# EAGLE design AxionAdapter (EAGLE 9.6.2)
REV: 1
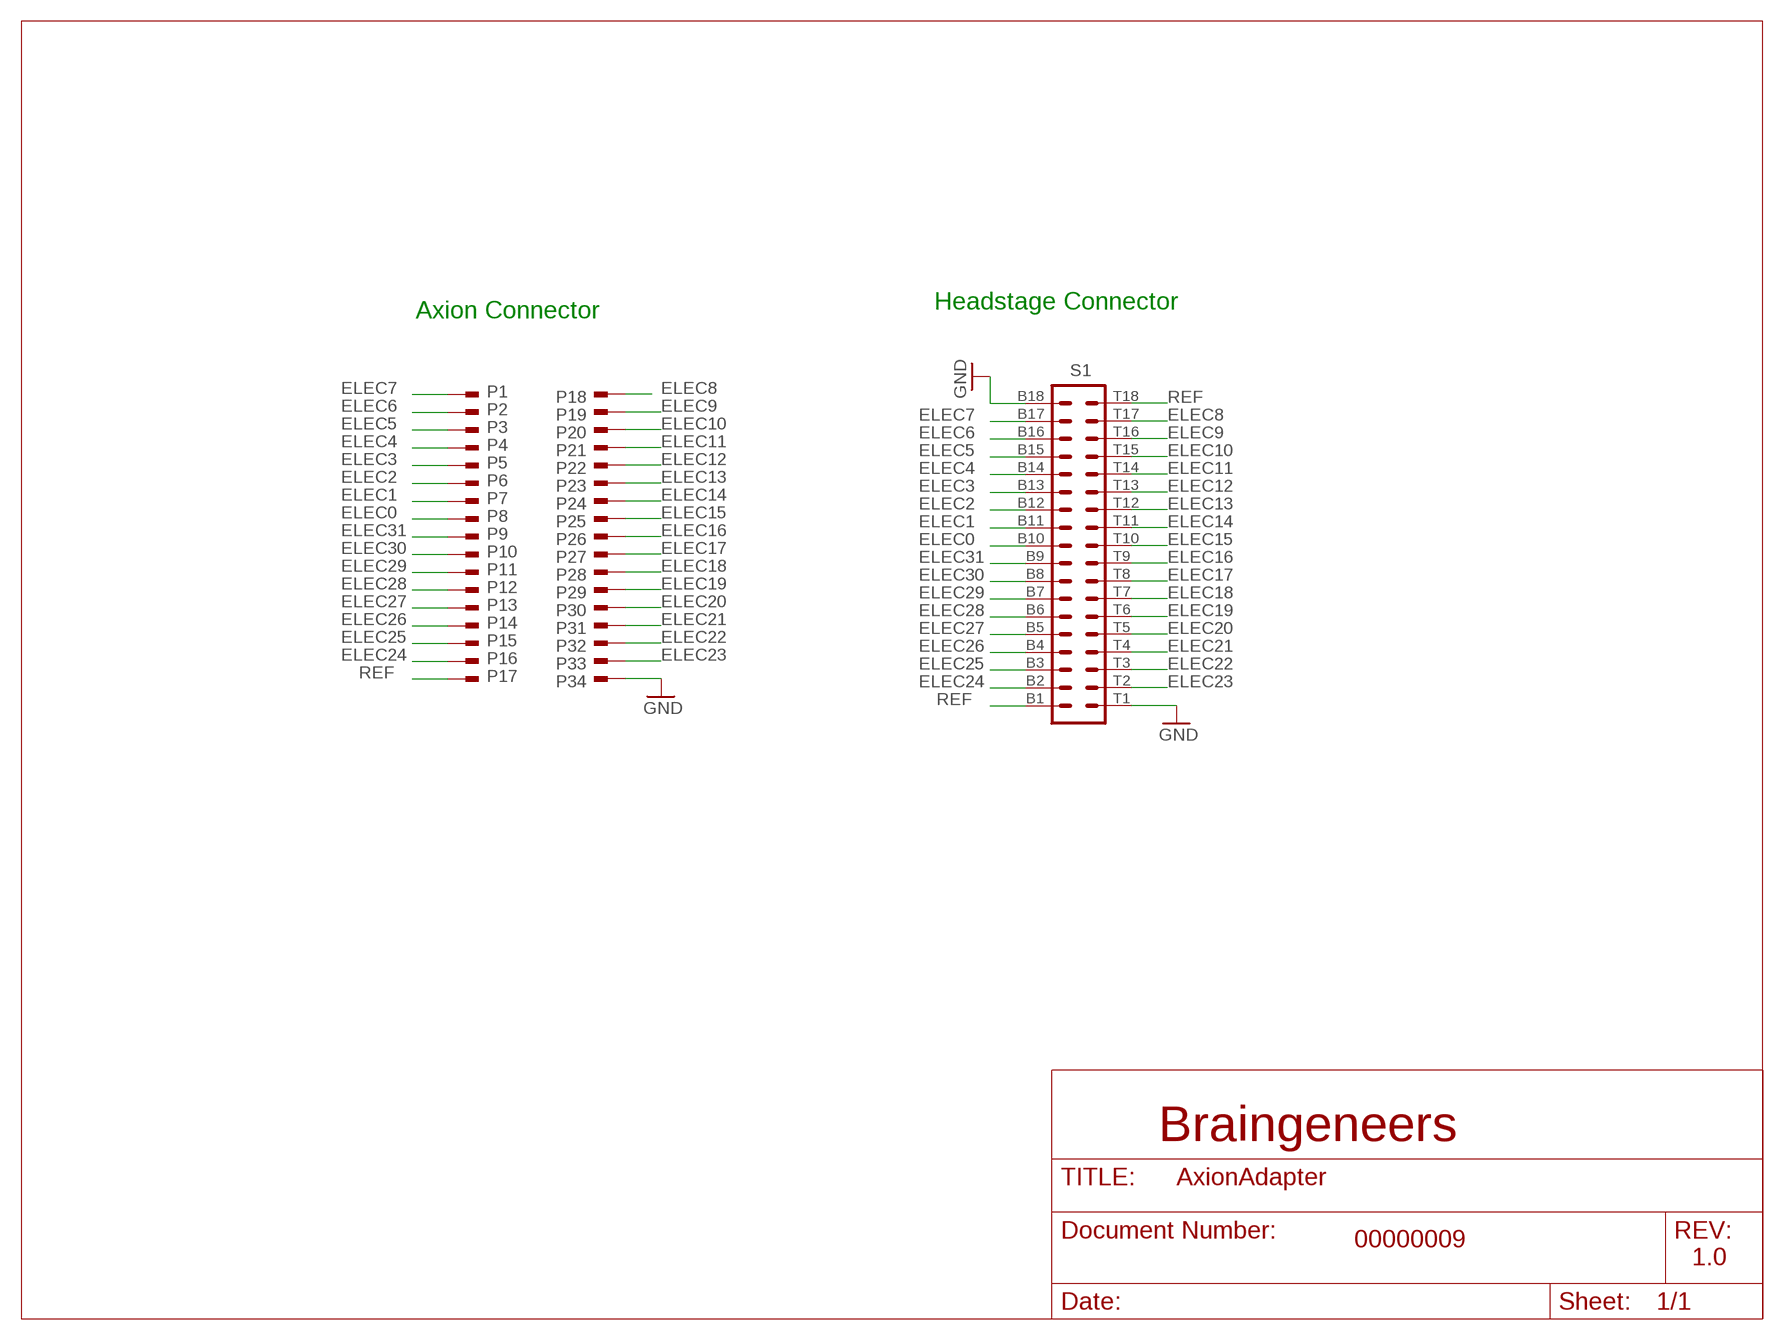
[diagram p0: schematic, sheet 1]

## Parts
P1  2336713-2_TE  [2336713-2_TE]
P2  2336713-2_TE  [2336713-2_TE]
P3  2336713-2_TE  [2336713-2_TE]
P4  2336713-2_TE  [2336713-2_TE]
P5  2336713-2_TE  [2336713-2_TE]
P6  2336713-2_TE  [2336713-2_TE]
P7  2336713-2_TE  [2336713-2_TE]
P8  2336713-2_TE  [2336713-2_TE]
P9  2336713-2_TE  [2336713-2_TE]
P10  2336713-2_TE  [2336713-2_TE]
P11  2336713-2_TE  [2336713-2_TE]
P12  2336713-2_TE  [2336713-2_TE]
P13  2336713-2_TE  [2336713-2_TE]
P14  2336713-2_TE  [2336713-2_TE]
P15  2336713-2_TE  [2336713-2_TE]
P16  2336713-2_TE  [2336713-2_TE]
P17  2336713-2_TE  [2336713-2_TE]
P18  2336713-2_TE  [2336713-2_TE]
P19  2336713-2_TE  [2336713-2_TE]
P20  2336713-2_TE  [2336713-2_TE]
P21  2336713-2_TE  [2336713-2_TE]
P22  2336713-2_TE  [2336713-2_TE]
P23  2336713-2_TE  [2336713-2_TE]
P24  2336713-2_TE  [2336713-2_TE]
P25  2336713-2_TE  [2336713-2_TE]
P26  2336713-2_TE  [2336713-2_TE]
P27  2336713-2_TE  [2336713-2_TE]
P28  2336713-2_TE  [2336713-2_TE]
P29  2336713-2_TE  [2336713-2_TE]
P30  2336713-2_TE  [2336713-2_TE]
P31  2336713-2_TE  [2336713-2_TE]
P32  2336713-2_TE  [2336713-2_TE]
P33  2336713-2_TE  [2336713-2_TE]
P34  2336713-2_TE  [2336713-2_TE]
S1  OMNETICS_A79024  [OMNETICS_A79024]

## Nets
ELEC0: P8.P$1 P8.P$2 S1.B10
ELEC1: P7.P$1 P7.P$2 S1.B11
ELEC2: P6.P$1 P6.P$2 S1.B12
ELEC3: P5.P$1 P5.P$2 S1.B13
ELEC4: P4.P$1 P4.P$2 S1.B14
ELEC5: P3.P$1 P3.P$2 S1.B15
ELEC6: P2.P$1 P2.P$2 S1.B16
ELEC7: P1.P$1 P1.P$2 S1.B17
ELEC8: P18.P$1 P18.P$2 S1.T17
ELEC9: P19.P$1 P19.P$2 S1.T16
ELEC10: P20.P$1 P20.P$2 S1.T15
ELEC11: P21.P$1 P21.P$2 S1.T14
ELEC12: P22.P$1 P22.P$2 S1.T13
ELEC13: P23.P$1 P23.P$2 S1.T12
ELEC14: P24.P$1 P24.P$2 S1.T11
ELEC15: P25.P$1 P25.P$2 S1.T10
ELEC16: P26.P$1 P26.P$2 S1.T9
ELEC17: P27.P$1 P27.P$2 S1.T8
ELEC18: P28.P$1 P28.P$2 S1.T7
ELEC19: P29.P$1 P29.P$2 S1.T6
ELEC20: P30.P$1 P30.P$2 S1.T5
ELEC21: P31.P$1 P31.P$2 S1.T4
ELEC22: P32.P$1 P32.P$2 S1.T3
ELEC23: P33.P$1 P33.P$2 S1.T2
ELEC24: P16.P$1 P16.P$2 S1.B2
ELEC25: P15.P$1 P15.P$2 S1.B3
ELEC26: P14.P$1 P14.P$2 S1.B4
ELEC27: P13.P$1 P13.P$2 S1.B5
ELEC28: P12.P$1 P12.P$2 S1.B6
ELEC29: P11.P$1 P11.P$2 S1.B7
ELEC30: P10.P$1 P10.P$2 S1.B8
ELEC31: P9.P$1 P9.P$2 S1.B9
GND [power]: P34.P$1 P34.P$2 S1.B18 S1.T1
REF: P17.P$1 P17.P$2 S1.B1 S1.T18

## Notes on the sheet
- Headstage Connector
- Axion Connector
- Braingeneers
- 00000009
- 1.0

## Library data of the parts
P1-P34 = Braingeneers_Lib:2336713-2_TE
S1 = Braingeneers_Lib:OMNETICS_A79024: Omnetics A79024 36-pin connector

## Net classes
0 default: width 0.152 mm
1 thick: width 0.254 mm
2 power: width 0.61 mm
3 diff pairs: width 0.152 mm

## Board
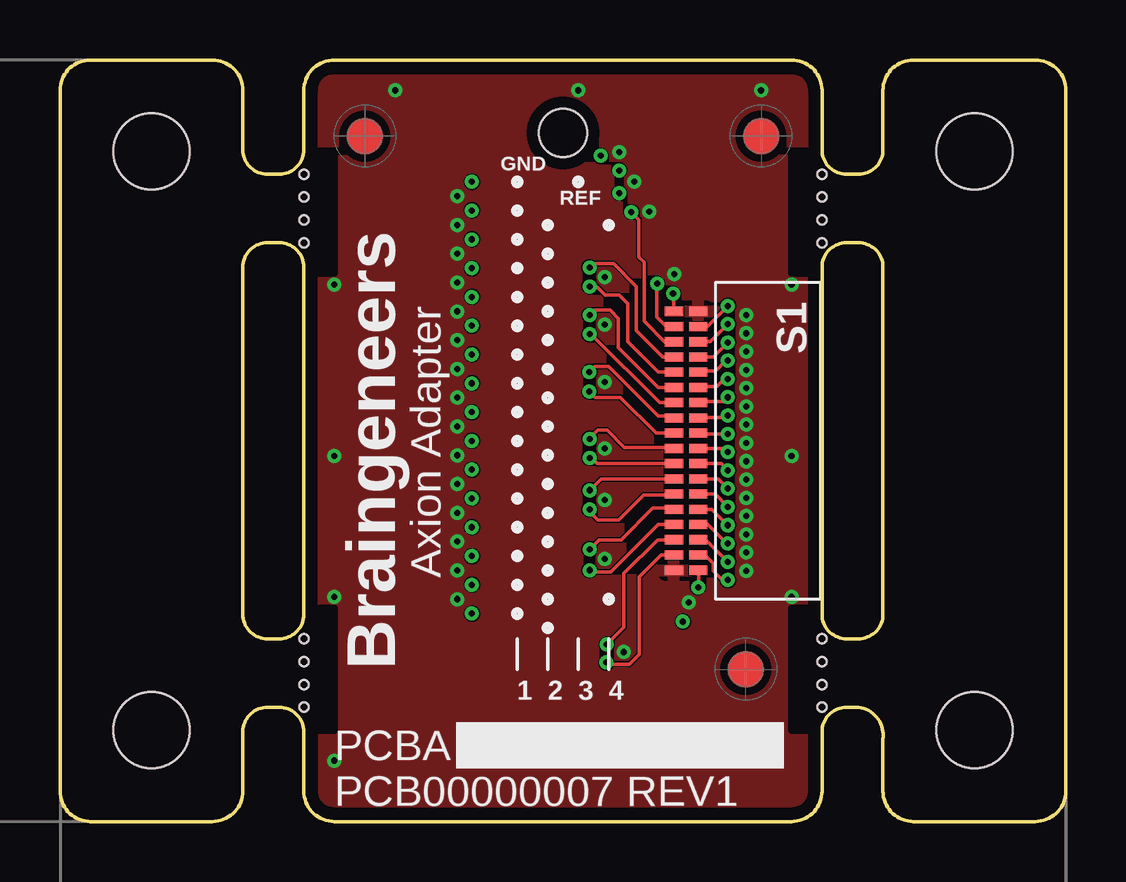
[diagram p1: board, top side]
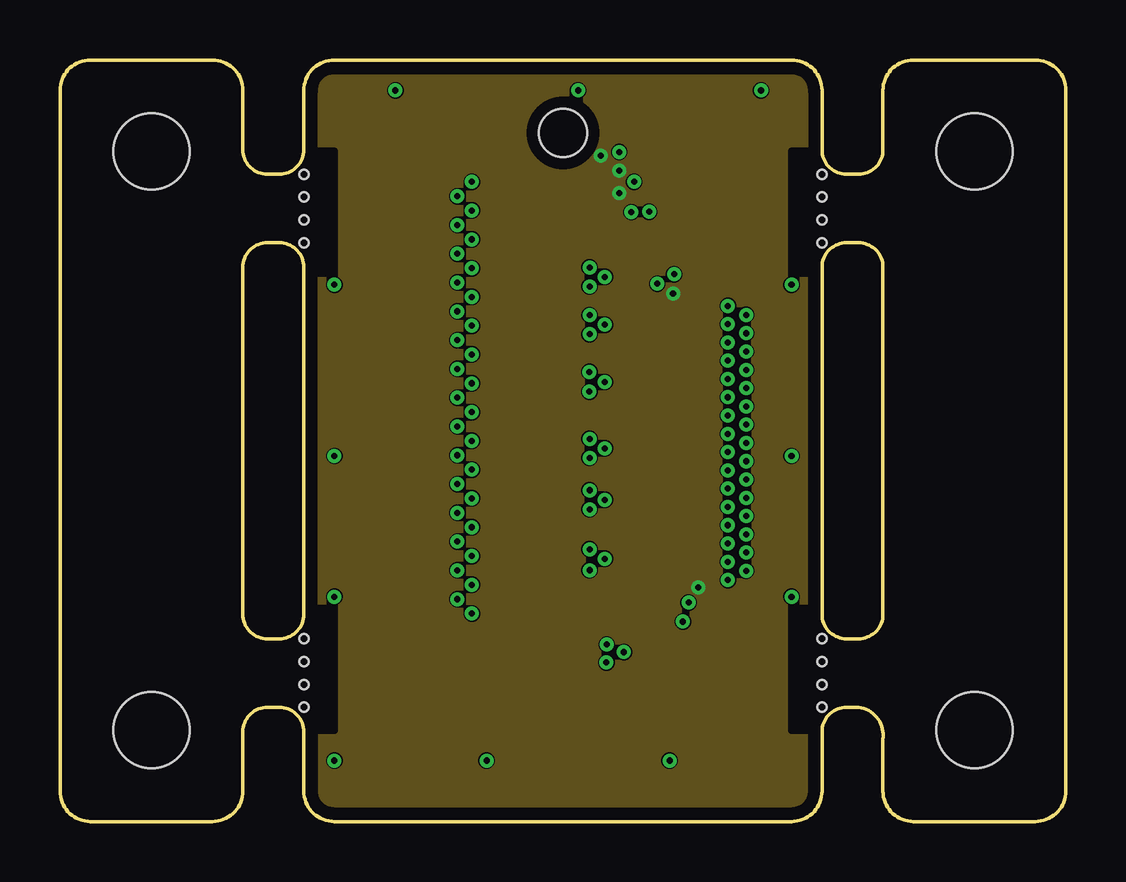
[diagram p2: board, inner layer Signal/Power2]
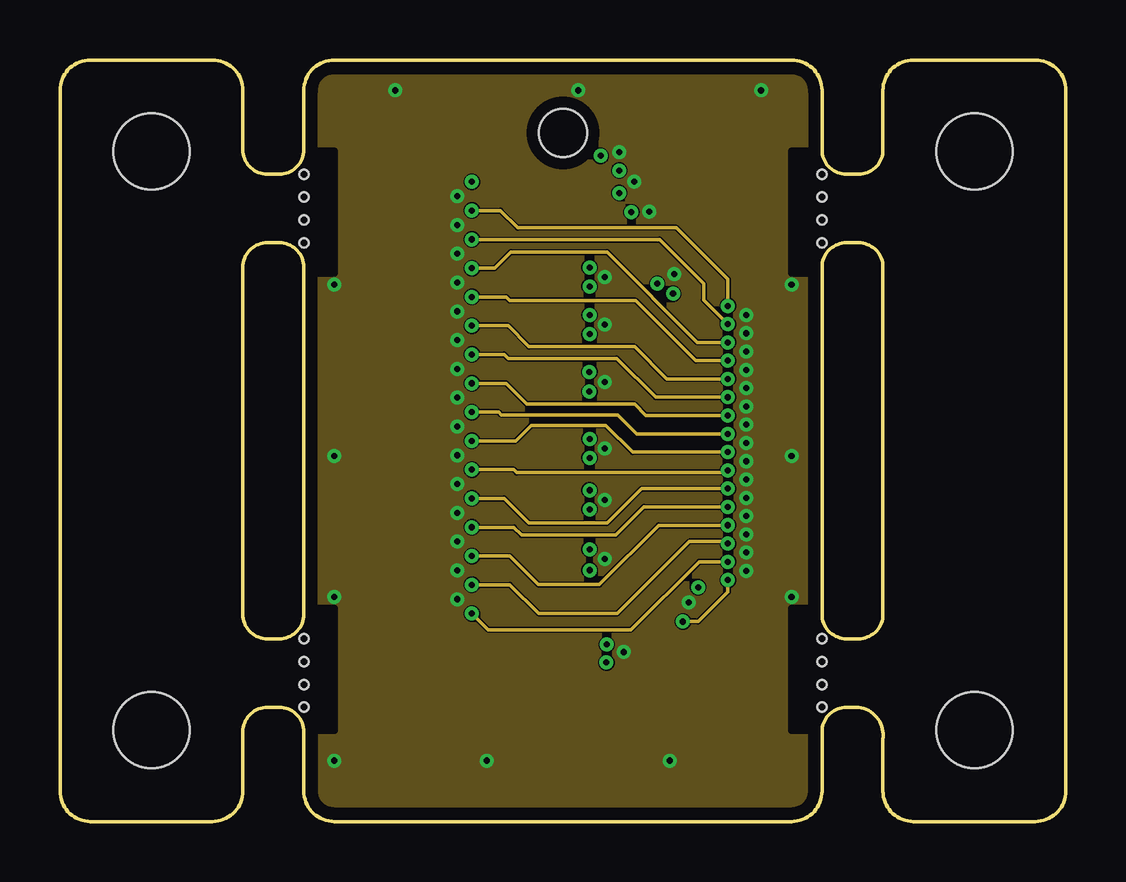
[diagram p3: board, inner layer Signal/Power3]
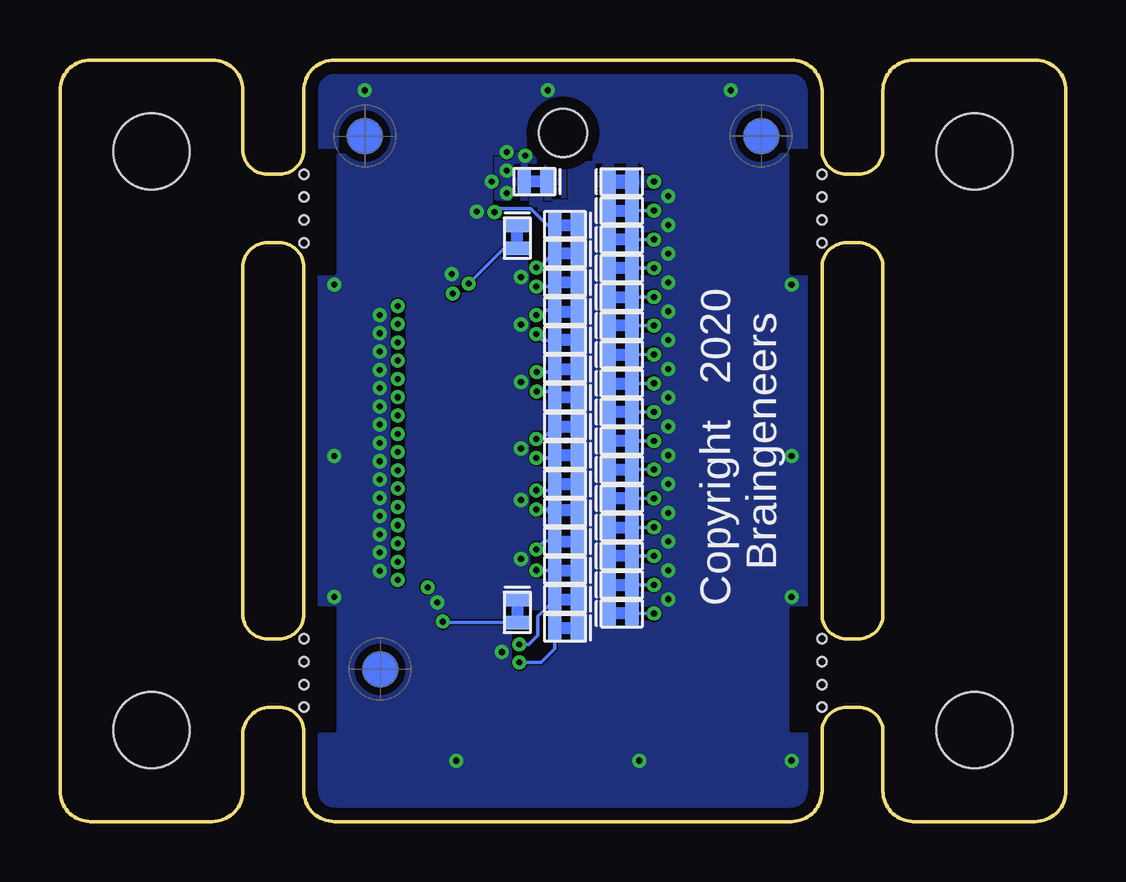
[diagram p4: board, bottom side, seen from below]

Size 41.91 x 31.75 mm. Coordinates in mm from the lower left corner, seen from the top.
Outline: 31.75,1.27 31.75,3.75 arc-90 32.77,4.76 33.27,4.76 arc-90 34.29,3.43 34.29,1.27 arc90 35.56,0 40.64,0 arc90 41.91,1.27 41.91,30.48 arc90 40.64,31.75 35.56,31.75 arc90 34.29,30.48 34.29,28 arc-90 33.27,26.99 32.77,26.99 arc-90 31.75,28 31.75,30.48 arc90 30.48,31.75 11.43,31.75 arc90 10.16,30.48 10.16,28 arc-90 9.14,26.99 8.64,26.99 arc-90 7.62,28 7.62,30.48 arc90 6.35,31.75 1.27,31.75 arc90 0,30.48 0,1.27 arc90 1.27,0 6.35,0 arc90 7.62,1.27 7.62,3.75 arc-90 8.64,4.76 9.14,4.76 arc-90 10.16,3.75 10.16,1.27 arc90 11.43,0 30.48,0 arc90 31.75,1.27
Outline: 8.64,24.13 9.14,24.13 arc-90 10.16,23.11 10.16,8.64 arc-90 9.14,7.62 8.64,7.62 arc-90 7.62,8.64 7.62,23.11 arc-90 8.64,24.13
Outline: 31.75,8.64 31.75,23.11 arc-90 32.77,24.13 33.27,24.13 arc-90 34.29,23.11 34.29,8.64 arc-90 33.27,7.62 32.77,7.62 arc-90 31.75,8.64
Copper layers (1+2*15+16): Top(GND)1 0.035mm / dielectric 8mil / Signal/Power2 0.035mm / dielectric 1.0284mm / Signal/Power3 0.035mm / dielectric 8mil / Bottom(GND)4 0.035mm
Design rules "default *": minimum track width 2mil, minimum drill 10mil, track to track 2mil, track to pad 6.5mil, pad to pad 6mil, via to via 6.25mil, smd to smd 6mil, copper to edge 20mil, drill to drill 15mil, minimum pad ring 6.5mil, minimum via ring 6.5mil, stop-mask expansion 3mil, vias tented up to drill 12mil, thermal gap 10mil
Holes 0.38 mm at 31.75,4.76 31.75,7.62 31.75,6.67 31.75,5.72 31.75,24.13 31.75,26.99 31.75,26.04 31.75,25.08 10.16,24.13 10.16,26.99 10.16,26.04 10.16,25.08 10.16,4.76 10.16,7.62 10.16,6.67 10.16,5.72
Holes 3.17 mm at 38.1,3.81 38.1,27.94 3.81,27.94 3.81,3.81
Holes 2 mm at 20.96,28.7
tKeepout: area 10.2,22.9 to 11.4,27.9; area 10.2,3.8 to 11.4,8.9; area 30.5,3.8 to 31.8,8.9; area 30.5,22.9 to 31.8,27.9
bKeepout: area 10.2,22.9 to 11.4,27.9; area 10.2,3.8 to 11.4,8.9; area 30.5,3.8 to 31.8,8.9; area 30.5,22.9 to 31.8,27.9
tRestrict: area 10.2,22.9 to 11.4,27.9; area 30.5,22.9 to 31.8,27.9; area 30.5,3.8 to 31.8,8.9; area 10.2,3.8 to 11.4,8.9
bRestrict: area 10.2,22.9 to 11.4,27.9; area 10.2,3.8 to 11.4,8.9; area 30.5,3.8 to 31.8,8.9; area 30.5,22.9 to 31.8,27.9

### Footprints (pad centres in the part's own frame; a part is rotated, then mirrored left to right if it is on the bottom)
2336713-2_TE = smd 0.55 x 1: P$1 -0.975,0 | smd 0.6 x 1: P$2 0,0
OMNETICS_A79024 = smd 0.381 x 0.762: B1 -5.397,0.711; B2 -4.763,0.711; B3 -4.128,0.711; B4 -3.493,0.711; B5 -2.857,0.711; B6 -2.223,0.711; B7 -1.587,0.711; B8 -0.953,0.711; B9 -0.318,0.711; B10 0.318,0.711; B11 0.953,0.711; B12 1.587,0.711; B13 2.223,0.711; B14 2.857,0.711; B15 3.493,0.711; B16 4.128,0.711; B17 4.763,0.711; B18 5.397,0.711; T1 -5.397,1.727; T2 -4.763,1.727; T3 -4.128,1.727; T4 -3.493,1.727; T5 -2.857,1.727; T6 -2.223,1.727; T7 -1.587,1.727; T8 -0.953,1.727; T9 -0.318,1.727; T10 0.318,1.727; T11 0.953,1.727; T12 1.587,1.727; T13 2.223,1.727; T14 2.857,1.727; T15 3.493,1.727; T16 4.128,1.727; T17 4.763,1.727; T18 5.397,1.727

### Placement (x,y rotation side)
DRILEGEND  [DRILEGEND]  21.47,-22.92 0 top  (outside the outline)
P1  19.05,25.47 180 bottom
P2  19.05,24.27 180 bottom
P3  19.05,23.07 180 bottom
P4  19.05,21.87 180 bottom
P5  19.05,20.67 180 bottom
P6  19.05,19.47 180 bottom
P7  19.05,18.27 180 bottom
P8  19.05,17.07 180 bottom
P9  19.05,15.87 180 bottom
P10  19.05,14.67 180 bottom
P11  19.05,13.47 180 bottom
P12  19.05,12.27 180 bottom
P13  19.05,11.07 180 bottom
P14  19.05,9.87 180 bottom
P15  19.05,8.67 180 bottom
P16  22.86,9.27 90 bottom
P17  21.59,26.67 0 bottom
P18  22.86,24.87 90 bottom
P19  20.32,24.87 0 bottom
P20  20.32,23.67 0 bottom
P21  20.32,22.47 0 bottom
P22  20.32,21.27 0 bottom
P23  20.32,20.07 0 bottom
P24  20.32,18.87 0 bottom
P25  20.32,17.67 0 bottom
P26  20.32,16.47 0 bottom
P27  20.32,15.27 0 bottom
P28  20.32,14.07 0 bottom
P29  20.32,12.87 0 bottom
P30  20.32,11.67 0 bottom
P31  20.32,10.47 0 bottom
P32  20.32,9.27 0 bottom
P33  20.32,8.07 0 bottom
P34  19.05,26.67 180 bottom
S1  27.3,15.88 90 top
U$1  [FIDUCIAL_G15]  12.7,28.58 270 top
U$2  [FIDUCIAL_G15]  12.7,28.58 270 bottom
U$7  [NASS_LOGO_LG]  27.42,2.48 349.7 bottom
U$31  [ROHS_LG]  24.44,9.01 0 top
U$35  [FIDUCIAL_G15]  29.21,28.58 270 top
U$49  [FIDUCIAL_G15]  28.58,6.35 90 top
U$50  [FIDUCIAL_G15]  28.58,6.35 270 bottom
U$52  [A5L-LOC]  -25.3,-72.07 0 top  (outside the outline)
U$70  [NO_TRASH_LG]  22.96,16.64 0 top
U$72  [STATIC_LG]  23.54,12.53 0 top
U$73  [FIDUCIAL_G15]  29.21,28.58 0 bottom
U$84  [COMPYRIGHT_MED]  13.34,17.15 270 top

### Tracks (layer width: path | path; a pad name or v marks a point on that pad's centre or on a via)
ELEC0  (via drill 0.25)
  Top(GND)1 0.152: v27.83,16.16 26.62,16.16
  Top(GND)1 0.178: S1.B10 26.62,16.16
  Signal/Power3 0.152: v27.83,16.16 24.02,16.16 23.23,16.95 18.39,16.95 18.27,17.07 v17.16,17.07
  Bottom(GND)4 0.152: v17.16,17.07 P8.P$1
  Bottom(GND)4 0.508: P8.P$1 P8.P$2
ELEC1  (via drill 0.25)
  Top(GND)1 0.152: v27.83,16.93 27.75,16.85 26.61,16.85
  Top(GND)1 0.178: 26.61,16.85 S1.B11
  Signal/Power3 0.152: v27.83,16.93 24.42,16.93 23.94,17.4 19.46,17.4 18.59,18.27 v17.16,18.27
  Bottom(GND)4 0.152: v17.16,18.27 P7.P$1
  Bottom(GND)4 0.508: P7.P$2 P7.P$1
ELEC2  (via drill 0.25)
  Top(GND)1 0.152: v27.83,17.69 27.65,17.51 26.64,17.51 S1.B12
  Signal/Power3 0.152: v17.16,19.47 18.51,19.47 18.67,19.31 23.19,19.31 24.81,17.69 v27.83,17.69
  Bottom(GND)4 0.152: v17.16,19.47 P6.P$1
  Bottom(GND)4 0.508: P6.P$2 P6.P$1
ELEC3  (via drill 0.25)
  Top(GND)1 0.152: S1.B13 26.64,18.14 27.36,18.14 27.67,18.45 v27.83,18.45
  Signal/Power3 0.152: v17.16,20.67 18.67,20.67 19.54,19.8 23.94,19.8 25.29,18.45 v27.83,18.45
  Bottom(GND)4 0.152: v17.16,20.67 P5.P$1
  Bottom(GND)4 0.508: P5.P$1 P5.P$2
ELEC4  (via drill 0.25)
  Top(GND)1 0.152: S1.B14 26.64,18.78 27.31,18.78 27.75,19.21 v27.83,19.21
  Signal/Power3 0.152: v17.16,21.87 18.59,21.87 18.75,21.71 24,21.71 26.5,19.21 v27.83,19.21
  Bottom(GND)4 0.152: v17.16,21.87 P4.P$1
  Bottom(GND)4 0.508: P4.P$2 P4.P$1
ELEC5  (via drill 0.25)
  Top(GND)1 0.152: v27.83,19.97 27.22,19.37 S1.B15
  Signal/Power3 0.152: v17.16,23.07 18.11,23.07 18.78,23.74 22.79,23.74 26.56,19.97 v27.83,19.97
  Bottom(GND)4 0.152: v17.16,23.07 P3.P$1
  Bottom(GND)4 0.508: P3.P$1 P3.P$2
ELEC6  (via drill 0.25)
  Top(GND)1 0.152: v27.83,20.74 27.09,20 S1.B16
  Signal/Power3 0.152: v17.16,24.27 24.99,24.27 26.82,22.43 26.82,21.74 v27.83,20.74
  Bottom(GND)4 0.152: v17.16,24.27 P2.P$1
  Bottom(GND)4 0.508: P2.P$1 P2.P$2
ELEC7  (via drill 0.25)
  Top(GND)1 0.152: v27.83,21.5 26.97,20.64 S1.B17
  Signal/Power3 0.152: v17.16,25.47 18.35,25.47 19.07,24.76 25.68,24.76 27.83,22.61 v27.83,21.5
  Bottom(GND)4 0.152: v17.16,25.47 P1.P$1
  Bottom(GND)4 0.508: P1.P$2 P1.P$1
ELEC8  (via drill 0.25)
  Top(GND)1 0.152: S1.T17 25.26,20.64 24.87,21.03 24.87,22.41 v24.89,22.43
  Bottom(GND)4 0.152: P18.P$1 23.42,23.9 v24.89,22.43
  Bottom(GND)4 0.508: P18.P$1 P18.P$2
ELEC9  (via drill 0.25)
  Top(GND)1 0.152: v23.81,25.41 24.12,25.1 24.12,23.54 24.34,23.31 24.34,20.86 25.25,19.96 25.53,19.96 S1.T16
  Bottom(GND)4 0.152: P19.P$1 21.61,24.87 22.3,25.56 23.65,25.56 v23.81,25.41
  Bottom(GND)4 0.508: P19.P$1 P19.P$2
ELEC10  (via drill 0.25)
  Top(GND)1 0.152: S1.T15 25.12,19.37 24.01,20.48 24.01,22.31 23.07,23.26 22.23,23.26 v22.07,23.1
  Bottom(GND)4 0.152: v22.07,23.1 21.95,23.1 21.37,23.67 P20.P$1
  Bottom(GND)4 0.508: P20.P$2 P20.P$1
ELEC11  (via drill 0.25)
  Top(GND)1 0.152: v22.07,22.3 22.36,22.3 22.72,21.94 23.3,21.94 23.65,21.59 23.65,20.39 23.65,20 24.92,18.73 S1.T14
  Bottom(GND)4 0.152: v22.07,22.3 21.46,22.3 P21.P$1
  Bottom(GND)4 0.508: P21.P$2 P21.P$1
ELEC12  (via drill 0.25)
  Top(GND)1 0.152: S1.T13 24.92,18.1 23.26,19.76 23.26,20.98 22.92,21.32 22.27,21.32 v22.07,21.11
  Bottom(GND)4 0.152: P22.P$1 21.35,21.32 21.62,21.32 21.83,21.11 v22.07,21.11
  Bottom(GND)4 0.508: P22.P$1 P22.P$2
ELEC13  (via drill 0.25)
  Top(GND)1 0.152: v22.07,20.32 22.12,20.32 24.98,17.46 S1.T12
  Bottom(GND)4 0.152: P23.P$1 21.28,20.06 21.8,20.06 v22.07,20.32
  Bottom(GND)4 0.508: P23.P$2 P23.P$1
ELEC14  (via drill 0.25)
  Top(GND)1 0.152: S1.T11 25.5,16.91 24.92,16.91 22.86,18.97 22.28,18.97 v22.05,18.74
  Bottom(GND)4 0.152: v22.05,18.74 21.42,18.74 P24.P$1
  Bottom(GND)4 0.508: P24.P$1 P24.P$2
ELEC15  (via drill 0.25)
  Top(GND)1 0.152: S1.T10 24.84,16.19 23.35,17.69 22.29,17.69 v22.05,17.92
  Bottom(GND)4 0.152: P25.P$1 21.55,17.92 v22.05,17.92
  Bottom(GND)4 0.508: P25.P$2 P25.P$1
ELEC16  (via drill 0.25)
  Top(GND)1 0.152: S1.T9 25.53,15.6 23.51,15.6 22.8,16.32 22.41,16.32 22.07,15.98 v22.07,15.95
  Bottom(GND)4 0.152: v22.07,15.95 21.81,15.95 P26.P$1
  Bottom(GND)4 0.508: P26.P$1 P26.P$2
ELEC17  (via drill 0.25)
  Top(GND)1 0.152: v22.07,15.16 22.15,15.16 22.38,14.92 S1.T8
  Bottom(GND)4 0.152: P27.P$1 21.4,15.16 v22.07,15.16
  Bottom(GND)4 0.508: P27.P$2 P27.P$1
ELEC18  (via drill 0.25)
  Top(GND)1 0.152: v22.07,13.81 22.54,14.29 S1.T7
  Bottom(GND)4 0.152: P28.P$1 21.55,13.81 v22.07,13.81
  Bottom(GND)4 0.508: P28.P$1 P28.P$2
ELEC19  (via drill 0.25)
  Top(GND)1 0.152: v22.07,13.02 22.07,12.92 22.41,12.58 23.29,12.58 24.32,13.61 25.53,13.61 S1.T6
  Bottom(GND)4 0.152: v22.07,13.02 20.4,13.02 20.45,12.97 | P29.P$1 21.39,12.97
  Bottom(GND)4 0.508: P29.P$2 20.42,12.97 20.45,12.97 21.39,12.97
ELEC20  (via drill 0.25)
  Top(GND)1 0.152: v22.07,11.35 22.46,11.75 23.38,11.75 24.7,13.07 25.52,13.07 S1.T5
  Bottom(GND)4 0.152: v22.07,11.35 21.73,11.69 21.31,11.69 P30.P$1
  Bottom(GND)4 0.508: P30.P$1 P30.P$2
ELEC21  (via drill 0.25)
  Top(GND)1 0.152: v22.07,10.48 22.15,10.4 22.94,10.4 24.92,12.38 S1.T4
  Bottom(GND)4 0.152: v22.07,10.48 v22.06,10.47 P31.P$1
  Bottom(GND)4 0.508: P31.P$1 P31.P$2
ELEC22  (via drill 0.25)
  Top(GND)1 0.152: S1.T3 24.9,11.75 23.5,10.34 23.5,8.1 v22.78,7.38
  Bottom(GND)4 0.152: P32.P$1 22.01,8.56 22.01,7.76 22.38,7.38 v22.78,7.38
  Bottom(GND)4 0.508: P32.P$1 P32.P$2
ELEC23  (via drill 0.25)
  Top(GND)1 0.152: S1.T2 25.06,11.11 24.14,10.19 24.14,6.97 23.71,6.54 22.85,6.54 v22.77,6.63
  Bottom(GND)4 0.152: P33.P$1 21.3,7.2 21.86,6.63 v22.77,6.63
  Bottom(GND)4 0.508: P33.P$1 P33.P$2
ELEC24  (via drill 0.25)
  Top(GND)1 0.152: v27.83,10.07 27.59,10.07 27.22,10.44 27.22,10.77 26.87,11.11 S1.B2
  Signal/Power3 0.152: v27.83,10.07 27.83,9.57 26.59,8.33 v25.96,8.33
  Bottom(GND)4 0.152: P16.P$1 25.92,8.3 v25.96,8.33
  Bottom(GND)4 0.508: P16.P$2 P16.P$1
ELEC25  (via drill 0.25)
  Top(GND)1 0.152: v27.83,10.83 26.91,11.75 S1.B3
  Signal/Power3 0.152: v17.16,8.67 17.84,7.99 23.79,7.99 26.63,10.83 v27.83,10.83
  Bottom(GND)4 0.152: v17.16,8.67 P15.P$1
  Bottom(GND)4 0.508: P15.P$1 P15.P$2
ELEC26  (via drill 0.25)
  Top(GND)1 0.152: S1.B4 26.99,12.38 27.78,11.59 v27.83,11.59
  Signal/Power3 0.152: v27.83,11.59 27.75,11.68 26.22,11.68 23.21,8.67 19.95,8.67 18.75,9.87 v17.16,9.87
  Bottom(GND)4 0.152: v17.16,9.87 P14.P$1
  Bottom(GND)4 0.508: P14.P$2 P14.P$1
ELEC27  (via drill 0.25)
  Top(GND)1 0.152: v27.83,12.35 27.16,13.02 S1.B5
  Signal/Power3 0.152: v17.16,11.07 18.75,11.07 19.93,9.88 22.47,9.88 24.94,12.35 v27.83,12.35
  Bottom(GND)4 0.152: v17.16,11.07 P13.P$1
  Bottom(GND)4 0.508: P13.P$1 P13.P$2
ELEC28  (via drill 0.25)
  Top(GND)1 0.152: v27.83,13.12 27.29,13.65 S1.B6
  Signal/Power3 0.152: v17.16,12.27 18.91,12.27 19.24,11.94 23.15,11.94 24.33,13.12 v27.83,13.12
  Bottom(GND)4 0.152: v17.16,12.27 P12.P$1
  Bottom(GND)4 0.508: P12.P$2 P12.P$1
ELEC29  (via drill 0.25)
  Top(GND)1 0.152: v27.83,13.88 27.42,14.29 S1.B7
  Signal/Power3 0.152: v17.16,13.47 18.51,13.47 19.52,12.46 22.81,12.46 24.23,13.88 v27.83,13.88
  Bottom(GND)4 0.152: v17.16,13.47 P11.P$1
  Bottom(GND)4 0.508: P11.P$1 P11.P$2
ELEC30  (via drill 0.25)
  Top(GND)1 0.152: v27.83,14.64 27.55,14.92 S1.B8
  Signal/Power3 0.152: v27.83,14.64 27.75,14.64 27.66,14.55 19.02,14.55 18.91,14.67 v17.16,14.67
  Bottom(GND)4 0.152: v17.16,14.67 P10.P$1
  Bottom(GND)4 0.508: P10.P$2 P10.P$1
ELEC31  (via drill 0.25)
  Top(GND)1 0.152: v27.83,15.4 27.67,15.56 S1.B9
  Signal/Power3 0.152: v27.83,15.4 23.86,15.4 22.75,16.51 19.63,16.51 18.99,15.87 v17.16,15.87
  Bottom(GND)4 0.152: v17.16,15.87 P9.P$1
  Bottom(GND)4 0.508: P9.P$1 P9.P$2
ELEC38  (via drill 0.25)
  other vias: 17.16,26.67
GND  (via drill 0.25)
  Bottom(GND)4 0.61: P34.P$2 P34.P$1
  other vias: 16.56,26.07 16.56,24.87 16.56,23.67 16.56,22.47 16.56,21.27 16.56,20.07 16.56,18.87 16.56,17.67 16.56,16.47 16.56,15.27 16.56,14.07 16.56,12.87 16.56,11.67 16.56,10.47 16.56,9.27 22.7,15.56 22.7,18.32 22.7,13.41 22.7,22.7 22.7,20.72 26.19,9.13 25.59,22.82 28.59,10.45 28.59,21.12 28.59,20.36 28.59,19.59 28.59,18.83 28.59,18.07 28.59,17.31 28.59,16.55 28.59,15.78 28.59,15.02 28.59,14.26 28.59,13.5 28.59,12.74 28.59,11.97 28.59,11.21 22.7,10.95 23.5,7.06 23.92,26.67 24.55,25.43 23.3,27.91 13.97,30.48 21.59,30.48 29.21,30.48 30.48,22.38 30.48,15.24 11.43,22.38 25.4,2.54 11.43,2.54 17.78,2.54 11.43,9.37 11.43,15.24 30.48,9.37
  pour Top(GND)1 (rank 2): -13.97,44.53 49.53,44.45 49.49,-7.76 49.49,-7.76 49.49,-11.43 -13.97,-11.43
  pour Bottom(GND)4 (rank 2): -17.2,-14.53 52.5,-14.53 52.5,46.87 -17.2,46.87
  pour Signal/Power3: -10.16,41.91 48.26,41.91 48.26,-10.16 -10.16,-10.16
REF  (via drill 0.25)
  Top(GND)1 0.152: S1.B1 26.61,10.47 26.61,9.78 v26.59,9.76 | v25.54,22.01 25.58,21.97 S1.T18
  Bottom(GND)4 0.508: P17.P$2 P17.P$1
  other vias: 23.3,26.2 23.3,27.14 22.52,27.76
  pour Signal/Power2: -5.37,40.78 46.91,40.78 46.91,-8.3 -5.37,-8.3
  pour Bottom(GND)4: 20.96,26.04 20.96,27.78 23.66,27.78 23.66,26.04
TABS
  cutout Signal/Power3 (rank 2): 10.16,22.86 11.43,22.86 11.43,27.94 10.16,27.94
  cutout Signal/Power2 (rank 2): 10.16,22.86 11.43,22.86 11.43,27.94 10.16,27.94
TABS1
  cutout Signal/Power3: 10.16,3.81 11.43,3.81 11.43,8.89 10.16,8.89
TABS2
  cutout Signal/Power2: 30.48,3.81 31.75,3.81 31.75,8.89 30.48,8.89
  cutout Signal/Power3: 30.48,3.81 31.75,3.81 31.75,8.89 30.48,8.89
TABS3
  cutout Signal/Power2: 30.48,22.86 31.75,22.86 31.75,27.94 30.48,27.94
  cutout Signal/Power3: 30.48,22.86 31.75,22.86 31.75,27.94 30.48,27.94
TABS4
  cutout Signal/Power2 (rank 2): 10.16,3.81 11.43,3.81 11.43,8.89 10.16,8.89

### Text on the board
tPlace: GND | REF | Axion Adapter | Braingeneers | 1 | 2 | 3 | 4 | PCBA | PCB00000007 REV1
bPlace: Copyright 2020 / Braingeneers
Document: DWG 00000009 | REV 1 | UNLESS OTHERWISE SPECIFIED / / DIMENSIONS ARE IN INCHES / TOLERANCES ON; / 2 PL DECIMALS +/- 0.010 / 3 PL DECIMALS +/- 0.005 / ANGLES + / FRACTIONS +
tDocu: TOP | NOTES: UNLESS OTHERWISE SPECIFIED: / / 1. WORKMANSHIP SHALL BE IN ACCORDANCE / WITH IPC-A-610A CLASS 2 REQUIREMENTS. / / 2. NOTE POLARITY OF COMPONENTS WHEN INDICATED. / / 3. SQUARE PAD OR DOT INDICATES PIN 1 OF DEVICE, + END OF CAPACITOR, / CATHODE END OF DIODES, EMITTER OF TRANSISTOR / AND PIN 1 OF A CONNECTOR. / / 4. INSERT ASSEMBLED BOARD INTO CONDUCTIVE BAG. / / 5. SEE BOM FOR REFERENCE DESIGNATORS OF / STUFFED AND UNSTUFFED COMPONENTS. / / 6. REWORK MUST CONFORM TO IPC GUIDELINES IPC-R-700C. / / 7. PCB ASSEMBLY PROCESS AND VENDOR-SUPPLIED ASSEMBLY MATERIALS / MUST BE RoHS 2 COMPLIANT (2011/EU) AND REACH COMPLIANT (EC 1907/2006) / / 8. USE A NO-WASH ASSEMBLY PROCESS. USE ONLY NO-CLEAN FLUX. / / 9. SEE BOM FOR ANY ADDITIONAL ASSEMBLY NOTES. | ASSEMBLY
DOC: BOTTOM | ASSEMBLY
DrillLegend: LAYER-STACK
DrillLegend_01-16: 01-16
DrillLegend_01-20: 01-20
Notes: TOP SIDE | DRILL CHART (ALL UNITS IN MILS) | OK WITH DEFAULT TOLERANCES | NOTES: UNLESS OTHERWISE SPECIFIED: / / 1. PCB TO BE FABRICATED PER IPC GUIDELINES: / IPC-A-6012B OR LATEST REVISION. IPC-D-275 AND IPC-RB-276 CLASS 2 OR LATEST REVISION. / / 2. FINISHED BOARD TO BE 0.062IN +/- 10% THINK. / MATERIAL: ITEQ IT-180A, OR 370HR FR4, OR EQUIVALENT. / 4 LAYERS. LAYERS 1 AND 4 TO HAVE 1 OZ. MIN COPPER CLAD BEFORE PLATING, / AND PLATE PER IPC-6012. / COPPER PLATE ON WALL OF HOLES SHALL BE 0.001 AVERAGE, 0.0008 ABSOLUTE MINIMUM / / 3. MINIMUM ANNULAR RING IS O.002 FOR COMPONENT HOLES, TANGENCY FOR VIAS. / / 4. MASTER ARTWORK (FILM/GERBER DATA) IS NOT ETCH COMPENSATED. / COMPENSATE WORKING FILM SUCH THAT TRACE WIDTHS / MATCH TRACE WIDTHS OF MASTER ARTWORK WITHIN +/- 20% OF TRACE WIDTH / / 5. USE GREEN LIQUID PHOTO IMAGEABLE SOLDER MASK / CONFORMING TO IPC-SM-840C CLASS H. / BOARD TO HAVE SOLDER MASK OVER BARE COPPER ON BOTH SIDES. / NO SOLDER MASK TO PAD PERMISSIBLE, EXCEPT VIAS. / VIAS ARE TO BE MASKED PER ARTWORK MASTER. / / 6. SILKSCREEN BOTH SIDES USING SILKSCREEN MASTER. / SILKSCREEN TO BE WHITE NON-CONDUCTIVE, NON-NUTRIENT EPOXY INK, / OR ACRYLIC PRINT TAIYO IJR-4000 MW300. / / 7. WARPAGE NOT TO EXCEED 0.10 PER LINEAR INCH / / 8. PCB MUST PASS 100% ELECTRICAL TESTING / FOR OPENS AND SHORTS IN ACCORDANCE WITH IPC-ET-652. / TRUE NETLIST TESTING REQUIRED USING SUPPLIED IPC NETLIST. / / 9. ALL REWORK MUST FONCOFM TO IPC GUIDELINES: / IPC-R-700C (OR MOST CURRENT REVISION). / / 10. MINIMUM CONDUCTOR WITH TO BE 0.007”. / MINIMUM CONDUCTOR TO CONDUCTOR AND CONDUCTOR TO PAD SPACING TO BE 0.007” / / 11. SURFACE FINISH: ENIG (ELECTROLESS NICKEL IMMERSION GOLD) / 2-5 MICRO INCHES IMMERSION (SOFT) GOLD PLATE OVER 118-236 MICO INCHES NICKEL / / 12. ALL SOLDER PADS TO BE FREE OF SILKSCREEN INK. / / 13. PCB SHALL BE ROHS 2 COMPLIANT (2011/65/EU), REACH COMPLIANT (EC1907/2006) / AND COMPATIBLE WITH ROHS ASSEMBLY PROCESS / / 14. VIA REQUIREMENTS: FOLLOW SUPPLIED GERBERS. / SOLDER MASK ON PAD - FOLLOW SOLDER MASK GERBER FILES / / 15. OK TO ADD COPPER THIEVING TO SPARSELY POPULATED AREAS OF PCB AS NEEDED / / 16. IF COPPER PAD OR PLATED HOLES TOUCH BOARD OUTLINE, / FOLLOW GERBER AND ACCEPT COPPER EXPOSED AT BOARD EDGE / / 17. ADD TEARDROPS TO ALL PADS AT TRACE JUNCTIONS | SILKSCREEN TOP / SOLDER MASK TOP / ------------------------- / LAYER 1 - TOP GROUND (1 OZ) / PREPREG: DIELECTRIC (8 MIL) / LAYER 2 - SIGNAL PLANE (1 OZ) / CORE: DIELECTRIC (FILLER) / LAYER 3 - POWER PLANE (1 OZ) / PREPREG: DIELECTRIC (8 MIL) / LAYER 4 - BOTTOM GROUND (1 OZ) / ------------------------- / SOLDER MASK BOTTOM / SILKSCREEN BOTTOM / / / TOTAL BOARD THICKNESS: 62 MIL | FABRICATION